# Altium schematic sheet Sheet_1_2022-07-13.schdoc
size 291 x 203 mm
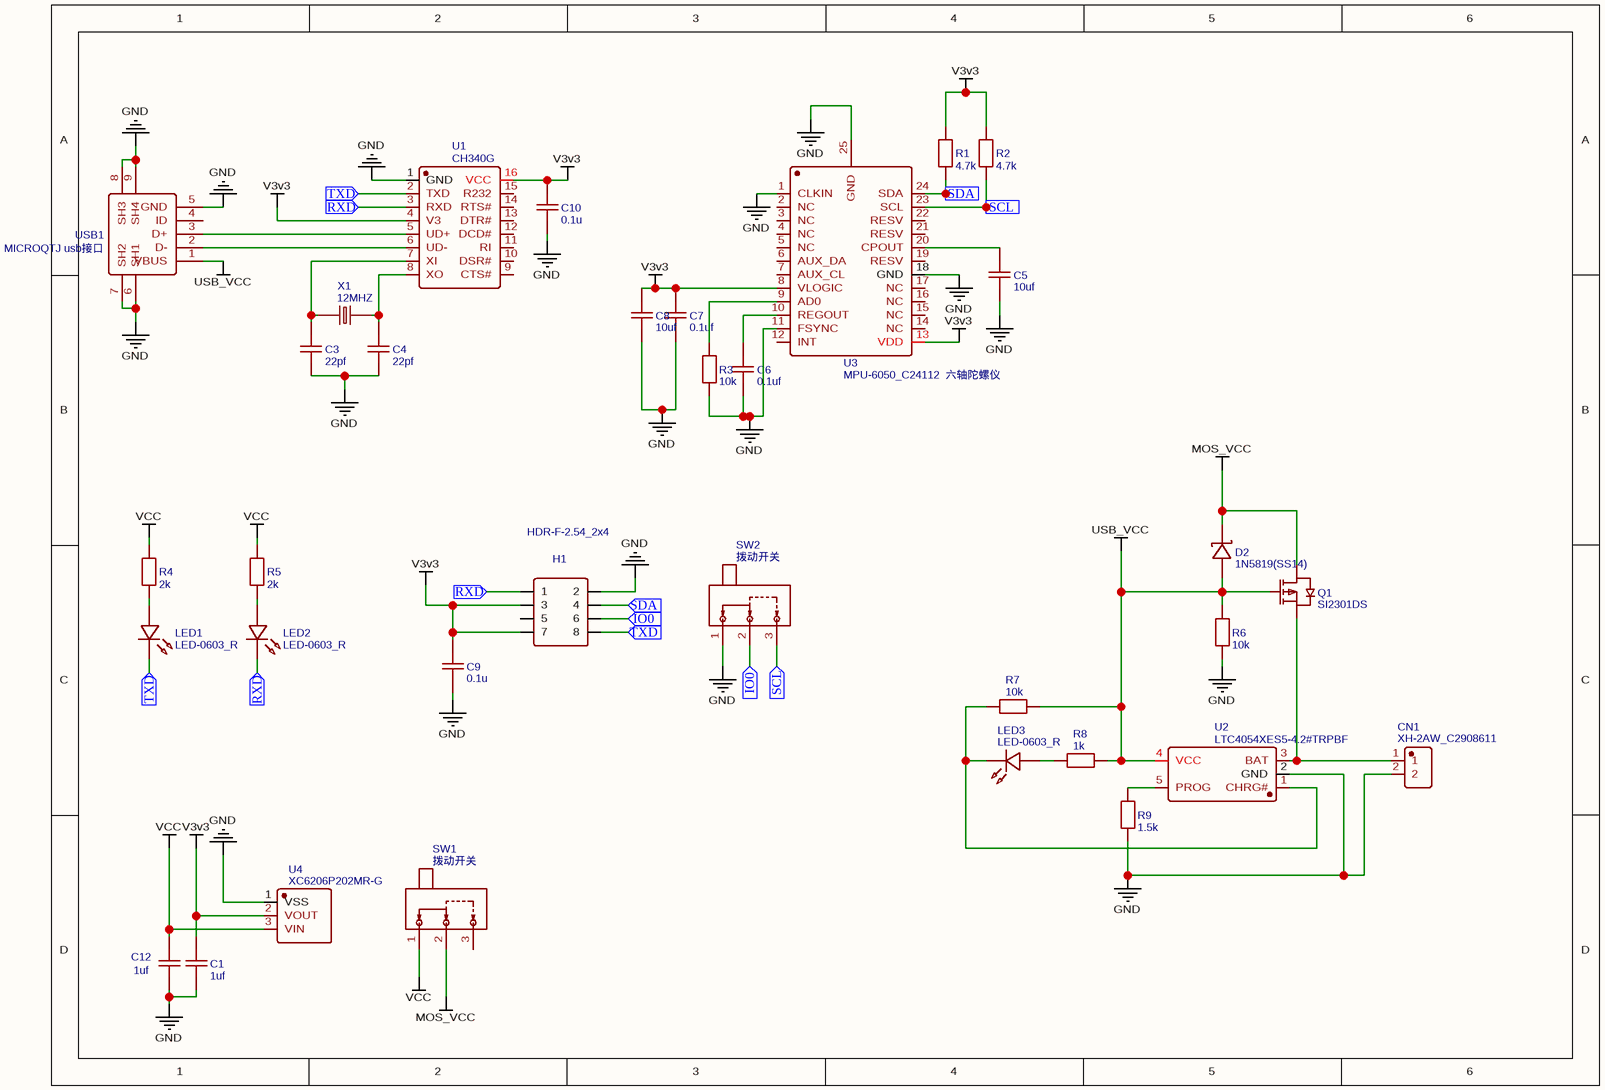
[diagram p0: Sheet_1_2022-07-13.schdoc]

## Parts
C1  1uf  [C0603]
C3  22pf  [C0603]
C4  22pf  [C0603]
C5  10uf  [C0603]
C6  0.1uf  [C0603]
C7  0.1uf  [C0603]
C8  10uf  [C0603]
C9  0.1u  [C0603]
C10  0.1u  [C0603]
C12  1uf  [C0603]
CN1  XH-2AW_C2908611  [CONN-TH_XH-2AW_C2908611]
D2  1N5819(SS14)  [DO-214AC_L4.3-W2.7-LS5.3-RD]
H1  HDR-F-2.54_2x4  [HDR-F-2.54_2X4]
LED1  LED-0603_R  [LED0603_RED]
LED2  LED-0603_R  [LED0603_RED]
LED3  LED-0603_R  [LED0603_RED]
Q1  SI2301DS  [SOT-23-3_L2.9-W1.3-P1.90-LS2.4-BR]
R1  4.7k  [R0805]
R2  4.7k  [R0805]
R3  10k  [R0805]
R4  2k  [R0805]
R5  2k  [R0805]
R6  10k  [R0805]
R7  10k  [R0805]
R8  1k  [R0805]
R9  1.5k  [R0805]
SW1  拨动开关  [SW-TH_SS-12D01-GX]
SW2  拨动开关  [SW-TH_SS-12D01-GX]
U1  CH340G  [SOIC-16_L9.9-W3.9-P1.27-LS6.0-BL]
U2  LTC4054XES5-4.2#TRPBF  [TSOT-23-5_L2.9-W1.6-P0.95-LS2.8-BR]
U3  MPU-6050_C24112  六轴陀螺仪  [QFN-24_L4.0-W4.0-P0.50-BL-EP2.7]
U4  XC6206P202MR-G  [SOT-23-3_L2.9-W1.6-P1.90-LS2.8-BR]
USB1  MICROQTJ usb接口  [MICRO-USB-SMD_MICROQTJ]
X1  12MHZ  [HC-49S_L11.4-W4.5-LS12.5]

## Ports
IO0 (in), RXD (in), SCL (in), SDA (in), TXD (in)

## Nets
GND: C1.2 C3.1 C4.1 C5.1 C6.1 C7.1 C8.1 C9.1 C10.1 C12.2 CN1.2 H1.2 R3.1 R6.2 R9.1 SW2.1 U1.1(GND) U2.2(GND) U3.1(CLKIN) U3.11(FSYNC) U3.18(GND) U3.25(GND) U4.1(VSS) USB1.5(GND) USB1.6(SH1) USB1.7(SH2) USB1.8(SH3) USB1.9(SH4)
MOS_VCC: D2.1(C) Q1.3(D) SW1.2
USB_VCC: D2.2(A) Q1.1(G) R6.1 R7.2 R8.2 U2.4(VCC) USB1.1(VBUS)
V3v3: C1.1 C7.2 C8.2 C9.2 C10.2 H1.3 H1.7 R1.2 R2.2 U1.4(V3) U1.16(VCC) U3.8(VLOGIC) U3.13(VDD) U4.2(VOUT)
VCC: C12.1 R4.2 R5.2 SW1.1 U4.3(VIN)
IO0: H1.6 SW2.2 ; port IO0
RXD: H1.1 LED2.2 U1.3(RXD) ; port RXD
SCL: R2.1 SW2.3 U3.23(SCL) ; port SCL
SDA: H1.4 R1.1 U3.24(SDA) ; port SDA
TXD: H1.8 LED1.2 U1.2(TXD) ; port TXD
NetC3_2: C3.2 U1.7(XI) X1.1
NetC4_2: C4.2 U1.8(XO) X1.2
NetC5_2: C5.2 U3.20(CPOUT)
NetC6_2: C6.2 U3.10(REGOUT)
NetCN1_1: CN1.1 Q1.2(S) U2.3(BAT)
NetLED1_1: LED1.1 R4.1
NetLED2_1: LED2.1 R5.1
NetLED3_1: LED3.1 R8.1
NetLED3_2: LED3.2 R7.1 U2.1(CHRG#)
NetR3_2: R3.2 U3.9(AD0)
NetR9_2: R9.2 U2.5(PROG)
NetU1_5: U1.5(UD+) USB1.3(D+)
NetU1_6: U1.6(UD-) USB1.2(D-)

Not connected (* = marked no-connect by the designer): H1 5; SW1 3; U1 9(CTS#) 10(DSR#) 11(RI) 12(DCD#) 13(DTR#) 14(RTS#) 15(R232); U3 2(NC) 3(NC) 4(NC) 5(NC) 6(AUX_DA) 7(AUX_CL) 12(INT) 14(NC) 15(NC) 16(NC) 17(NC) 19(RESV) 21(RESV) 22(RESV); USB1 4(ID)

## Library data of the parts
C1 C12 = 1uf: nameAlias: Value(F); Contributor: LCEDA_Lib; spicePre: C; spiceSymbolName: C_0603_US
C3 C4 = 22pf: nameAlias: Value(F); Contributor: LCEDA_Lib; spicePre: C; spiceSymbolName: C_0603_US
C5 C8 = 10uf: nameAlias: Value(F); Contributor: LCEDA_Lib; spicePre: C; spiceSymbolName: C_0603_US
C6 C7 = 0.1uf: nameAlias: Value(F); Contributor: LCEDA_Lib; spicePre: C; spiceSymbolName: C_0603_US
C9 C10 = 0.1u: nameAlias: Value(F); Contributor: LCEDA_Lib; spicePre: C; spiceSymbolName: C_0603_US
CN1 = XH-2AW_C2908611: BOM_Manufacturer: HCTL(华灿天禄); BOM_Manufacturer Part: XH-2AW; Contributor: LCSC; BOM_Supplier: LCSC; BOM_Supplier Part: C2908611; BOM_JLCPCB Part Class: Extended Part; spicePre: C; spiceSymbolName: XH-2AW_C2908611
D2 = 1N5819(SS14): BOM_Manufacturer: KEXIN; Contributor: LCSC; BOM_Supplier: LCSC; BOM_Supplier Part: C489138; BOM_Manufacturer Part: 1N5819(SS14); BOM_JLCPCB Part Class: Extended Part; spicePre: D; spiceSymbolName: 1N5819(SS14)
H1 = HDR-F-2.54_2x4: Contributor: LCEDA_Lib; BOM_Supplier Part: C239344; BOM_Supplier: LCSC; spicePre: H; spiceSymbolName: HDR-F-2.54_2x4
LED1-LED3 = LED-0603_R: BOM_Manufacturer: EVERLIGHT(台湾亿光); BOM_Manufacturer Part: 19-217/R6C-AL1M2VY/3T; Contributor: LCEDA_01; BOM_Supplier Part: C72044; BOM_Supplier: LCSC; spicePre: L; spiceSymbolName: LED-0603_R
Q1 = SI2301DS: BOM_Manufacturer: TECH PUBLIC(台舟); Contributor: LCSC; BOM_Supplier: LCSC; BOM_Supplier Part: C2841444; BOM_Manufacturer Part: SI2301DS; BOM_JLCPCB Part Class: Extended Part; spicePre: Q; spiceSymbolName: SI2301DS
R1 R2 = 4.7k: nameAlias: Value(Ω); Contributor: LCEDA_Lib; spicePre: R; spiceSymbolName: R_AXIAL-0.6_EU
R3 R6 R7 = 10k: nameAlias: Value(Ω); Contributor: LCEDA_Lib; spicePre: R; spiceSymbolName: R_AXIAL-0.6_EU
R4 R5 = 2k: nameAlias: Value(Ω); Contributor: LCEDA_Lib; spicePre: R; spiceSymbolName: R_AXIAL-0.6_EU
R8 = 1k: nameAlias: Value(Ω); Contributor: LCEDA_Lib; spicePre: R; spiceSymbolName: R_AXIAL-0.6_EU
R9 = 1.5k: nameAlias: Value(Ω); Contributor: LCEDA_Lib; spicePre: R; spiceSymbolName: R_AXIAL-0.6_EU
SW1 SW2 = 拨动开关: BOM_Manufacturer: G-Switch(品赞); BOM_Manufacturer Part: SS-12D01-G040; Contributor: LCSC; BOM_Supplier: LCSC; BOM_Supplier Part: C2876014; BOM_JLCPCB Part Class: Extended Part; spicePre: S; spiceSymbolName: SS-12D01-G040
U1 = CH340G: BOM_Manufacturer: WCH; timeStamp: 1468327462; BOM_Supplier: LCSC; BOM_Manufacturer Part: CH340G; BOM_Supplier Part: C14267; BOM_JLCPCB Part Class: Extended Part; spicePre: U; spiceSymbolName: CH340G
U2 = LTC4054XES5-4.2#TRPBF: BOM_Manufacturer: ADI(亚德诺)/LINEAR; Contributor: lcsc; BOM_Supplier: LCSC; BOM_Supplier Part: C687179; BOM_Manufacturer Part: LTC4054XES5-4.2#TRPBF; link: https://atta.szlcsc.comnull; spicePre: U; spiceSymbolName: LTC4054XES5-4.2#TRPBF
U3 = MPU-6050_C24112  六轴陀螺仪: BOM_Manufacturer: InvenSense; sourceId: 1T5FDZYC8; timeStamp: 1462265206; BOM_Supplier: LCSC; BOM_Manufacturer Part: MPU-6050; BOM_Supplier Part: C24112; BOM_JLCPCB Part Class: Basic Part; spicePre: U; spiceSymbolName: MPU-6050_C24112
U4 = XC6206P202MR-G: BOM_Manufacturer: TOREX(特瑞仕); Contributor: LCSC; BOM_Supplier: LCSC; BOM_Supplier Part: C2891260; BOM_Manufacturer Part: XC6206P202MR-G; BOM_JLCPCB Part Class: Extended Part; spicePre: U; spiceSymbolName: XC6206P202MR-G
USB1 = MICROQTJ usb接口: BOM_Manufacturer: SHOU HAN; Contributor: LCSC; BOM_Supplier: LCSC; BOM_Supplier Part: C404968; BOM_Manufacturer Part: MicroQTJ; BOM_JLCPCB Part Class: Extended Part; spicePre: U; spiceSymbolName: MICROQTJ
X1 = 12MHZ: BOM_Manufacturer: TAITIEN Elec; BOM_Manufacturer Part: XJHCELNANF-12MHZ; nameAlias: Frequency; Contributor: LCSC; BOM_Supplier: LCSC; BOM_Supplier Part: C295091; BOM_JLCPCB Part Class: Extended Part; spicePre: X; spiceSymbolName: XJHCELNANF-12MHZ